# Altium schematic sheet HorizBallControl.SchDoc: Horizontal Ball Control
size A4; SheetNumber: 6
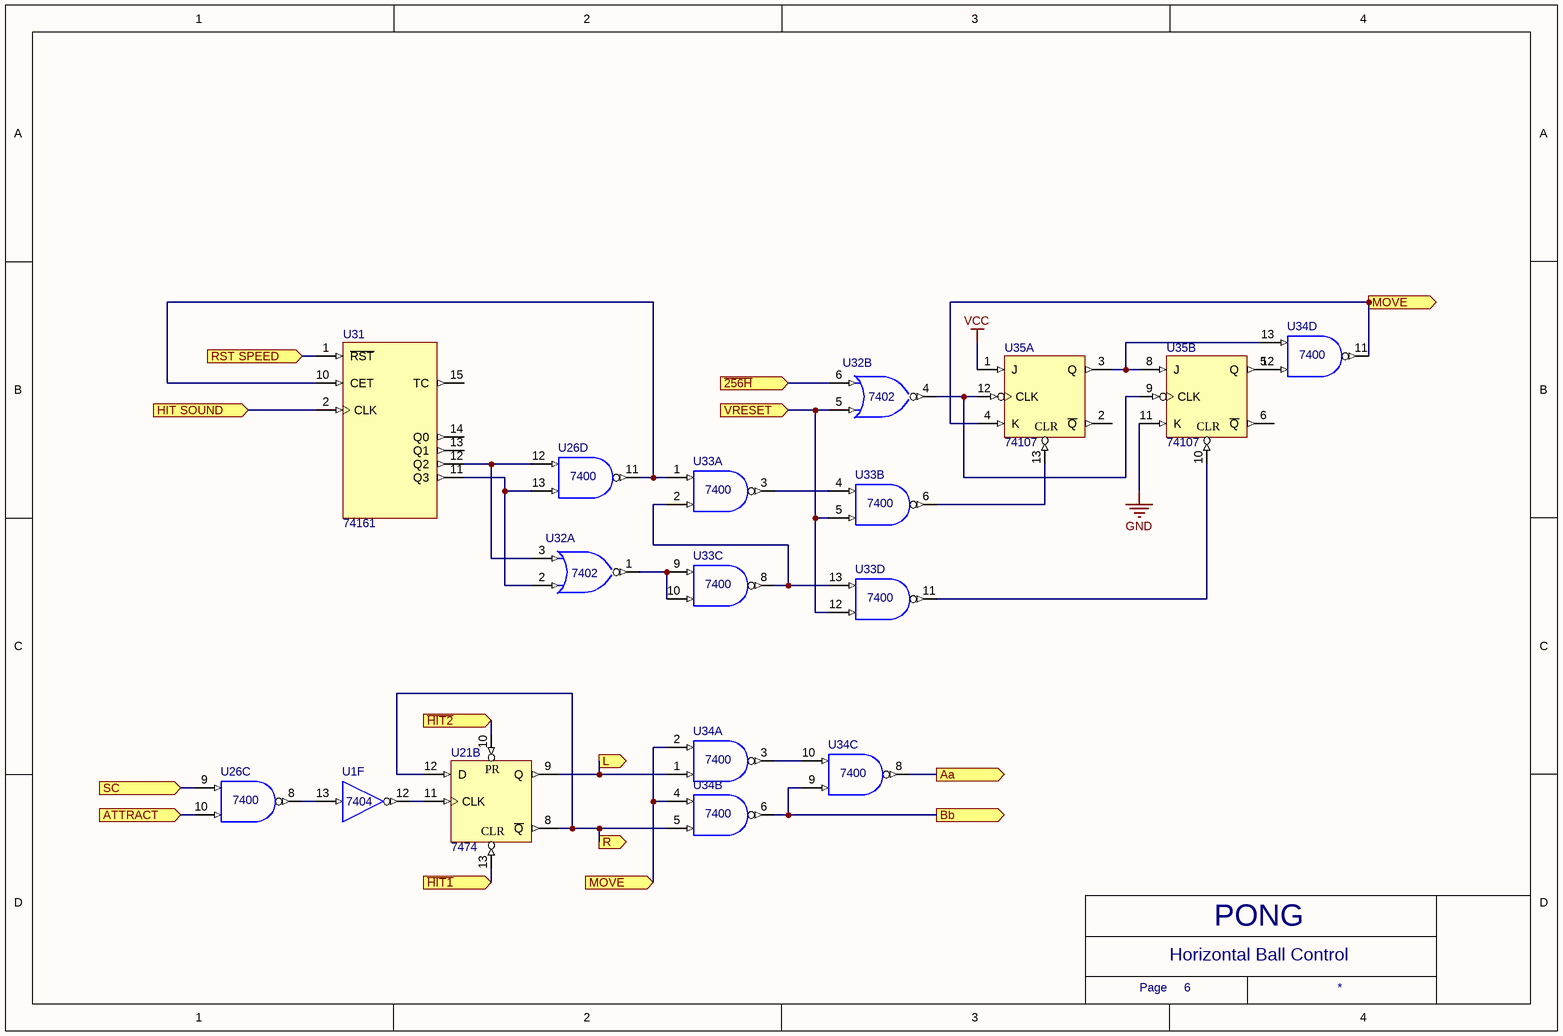
[diagram p0: HorizBallControl.SchDoc]

## Parts
U1  7404  [N014]  (part F of 6)
U21  7474  [N014D]  (part B of 2)
U26  7400  [N014]  (parts C,D of 4)
U31  74161  [N016]
U32  7402  [N014]  (parts A,B of 4)
U33  7400  [N014]  (parts A,B,C,D of 4)
U34  7400  [N014]  (parts A,B,C,D of 4)
U35  74107  [N014]  (parts A,B of 2)

## Ports
Aa, ATTRACT, Bb, HIT SOUND, L, MOVE, R, RST SPEED, SC, VRESET, ~{256H}, ~{HIT1}, ~{HIT2}

## Nets
GND: U1.7(GND) U21.7(GND) U26.7(GND) U31.8(GND) U32.7(GND) U33.7(GND) U34.7(GND) U35.7(GND) U35.11(K)
VCC: U1.14(VCC) U21.14(VCC) U26.14(VCC) U31.3(P0) U31.4(P1) U31.5(P2) U31.6(P3) U31.7(CEP) U31.9(~{PE}) U31.16(VCC) U32.14(VCC) U33.14(VCC) U34.14(VCC) U35.1(J) U35.14(VCC)
~{256H}: U32.6(B) ; port ~{256H}
~{HIT1}: U21.13(CLR) ; port ~{HIT1}
~{HIT2}: U21.10(PR) ; port ~{HIT2}
Aa: U34.8(Y) ; port Aa
ATTRACT: U26.10(B) ; port ATTRACT
Bb: U34.6(Y) U34.9(A) ; port Bb
HIT SOUND: U31.2(CLK) ; port HIT SOUND
L: U21.9(Q) U34.1(A) ; port L
MOVE: U34.2(B) U34.4(A) U34.11(Y) U35.4(K) ; port MOVE
R: U21.8(~{Q}) U21.12(D) U34.5(B) ; port R
RST SPEED: U31.1(~{RST}) ; port RST SPEED
SC: U26.9(A) ; port SC
VRESET: U32.5(A) U33.5(B) U33.12(A) ; port VRESET
NetU1_12: U1.12(Y) U21.11(CLK)
NetU1_13: U1.13(A) U26.8(Y)
NetU26_11: U26.11(Y) U31.10(CET) U33.1(A)
NetU26_12: U26.12(A) U31.12(Q2) U32.3(B)
NetU26_13: U26.13(B) U31.11(Q3) U32.2(A)
NetU32_1: U32.1(Y) U33.9(A) U33.10(B)
NetU32_4: U32.4(Y) U35.9(CLK) U35.12(CLK)
NetU33_2: U33.2(B) U33.8(Y) U33.13(B)
NetU33_3: U33.3(Y) U33.4(A)
NetU33_6: U33.6(Y) U35.13(CLR)
NetU33_11: U33.11(Y) U35.10(CLR)
NetU34_3: U34.3(Y) U34.10(B)
NetU34_12: U34.12(A) U35.5(Q)
NetU34_13: U34.13(B) U35.3(Q) U35.8(J)

Not connected (* = marked no-connect by the designer): U31 13(Q1) 14(Q0) 15(TC); U35 2(~{Q}) 6(~{Q})

## Notes on the sheet
- Text
- Page
- PONG

## Library data of the parts
U1 = SN74LS04N: Hex Inverter; Published: 8-Jun-2000; LatestRevisionDate: 04-Mar-2005; LatestRevisionNote: Stylized 3D Model Added.; DatasheetVersion: Mar-1988; PackageVersion: Oct-1995; PackageReference: N014; Publisher: Altium Limited; PackageDescription: DIP; 14 Leads; Row Spacing 7.62 mm; Pitch 2.54 mm; ComponentLink1Description: Manufacturer Link; ComponentLink1URL: http://www.ti.com/; ComponentLink2Description: Datasheet; ComponentLink2URL: http://www-s.ti.com/sc/ds/sn74ls04.pdf
U21 = SN74LS74AN: Dual D-Type Positive-Edge-Triggered Flip-Flop with Preset and Clear; Published: 8-Jun-2000; LatestRevisionDate: 04-Mar-2005; LatestRevisionNote: Stylized 3D Model Added.; DatasheetVersion: Mar-1988; PackageVersion: Oct-1995; PackageReference: N014D; Publisher: Altium Limited; PackageDescription: DIP; 14 Leads; Row Spacing 7.62 mm; Pitch 2.54 mm; ComponentLink1Description: Manufacturer Link; ComponentLink1URL: http://www.ti.com/; ComponentLink2Description: Datasheet; ComponentLink2URL: http://www-s.ti.com/sc/ds/sn74ls74a.pdf
U26 U33 U34 = SN74LS00N: Quadruple 2-Input Positive-NAND Gate; Published: 8-Jun-2000; LatestRevisionDate: 04-Mar-2005; LatestRevisionNote: Stylized 3D Model Added.; DatasheetVersion: Mar-1988; PackageVersion: Oct-1995; PackageReference: N014; Publisher: Altium Limited; PackageDescription: DIP; 14 Leads; Row Spacing 7.62 mm; Pitch 2.54 mm; ComponentLink1Description: Manufacturer Link; ComponentLink1URL: http://www.ti.com/; ComponentLink2Description: Datasheet; ComponentLink2URL: http://www-s.ti.com/sc/ds/sn74ls00.pdf
U31 = SN74LS161AN: Synchronous 4-Bit Counter; Published: 8-Jun-2000; LatestRevisionDate: 04-Mar-2005; LatestRevisionNote: Stylized 3D Model Added.; DatasheetVersion: Mar-1988; PackageVersion: Oct-1995; PackageReference: N016; Publisher: Altium Limited; PackageDescription: DIP; 16 Leads; Row Spacing 7.62 mm; Pitch 2.54 mm; Code_JEDEC: MS-001-BB; ComponentLink1Description: Manufacturer Link; ComponentLink1URL: http://www.ti.com/; ComponentLink2Description: Datasheet; ComponentLink2URL: http://www-s.ti.com/sc/ds/sn74ls161a.pdf; ComponentLink3Description: URL Link1; ComponentLink3URL: http://focus.ti.com/docs/prod/folders/print/sn74ls161a.html
U32 = SN74LS02N: Quadruple 2-Input Positive-NOR Gate; Published: 8-Jun-2000; LatestRevisionDate: 04-Mar-2005; LatestRevisionNote: Stylized 3D Model Added.; DatasheetVersion: Mar-1988; PackageVersion: Oct-1995; PackageReference: N014; Publisher: Altium Limited; PackageDescription: DIP; 14 Leads; Row Spacing 7.62 mm; Pitch 2.54 mm; ComponentLink1Description: Manufacturer Link; ComponentLink1URL: http://www.ti.com/; ComponentLink2Description: Datasheet; ComponentLink2URL: http://www-s.ti.com/sc/ds/sn54s02.pdf
U35 = SN74LS107AN: Dual J-K Flip-Flop with Clear; Published: 8-Jun-2000; LatestRevisionDate: 04-Mar-2005; LatestRevisionNote: Stylized 3D Model Added.; DatasheetVersion: Mar-1988; PackageVersion: Oct-1995; PackageReference: N014; Publisher: Altium Limited; PackageDescription: DIP; 14 Leads; Row Spacing 7.62 mm; Pitch 2.54 mm; ComponentLink1Description: Manufacturer Link; ComponentLink1URL: http://www.ti.com/; ComponentLink2Description: Datasheet; ComponentLink2URL: http://www-s.ti.com/sc/ds/sn74ls107a.pdf